# EAGLE design main (EAGLE 7.5.0)
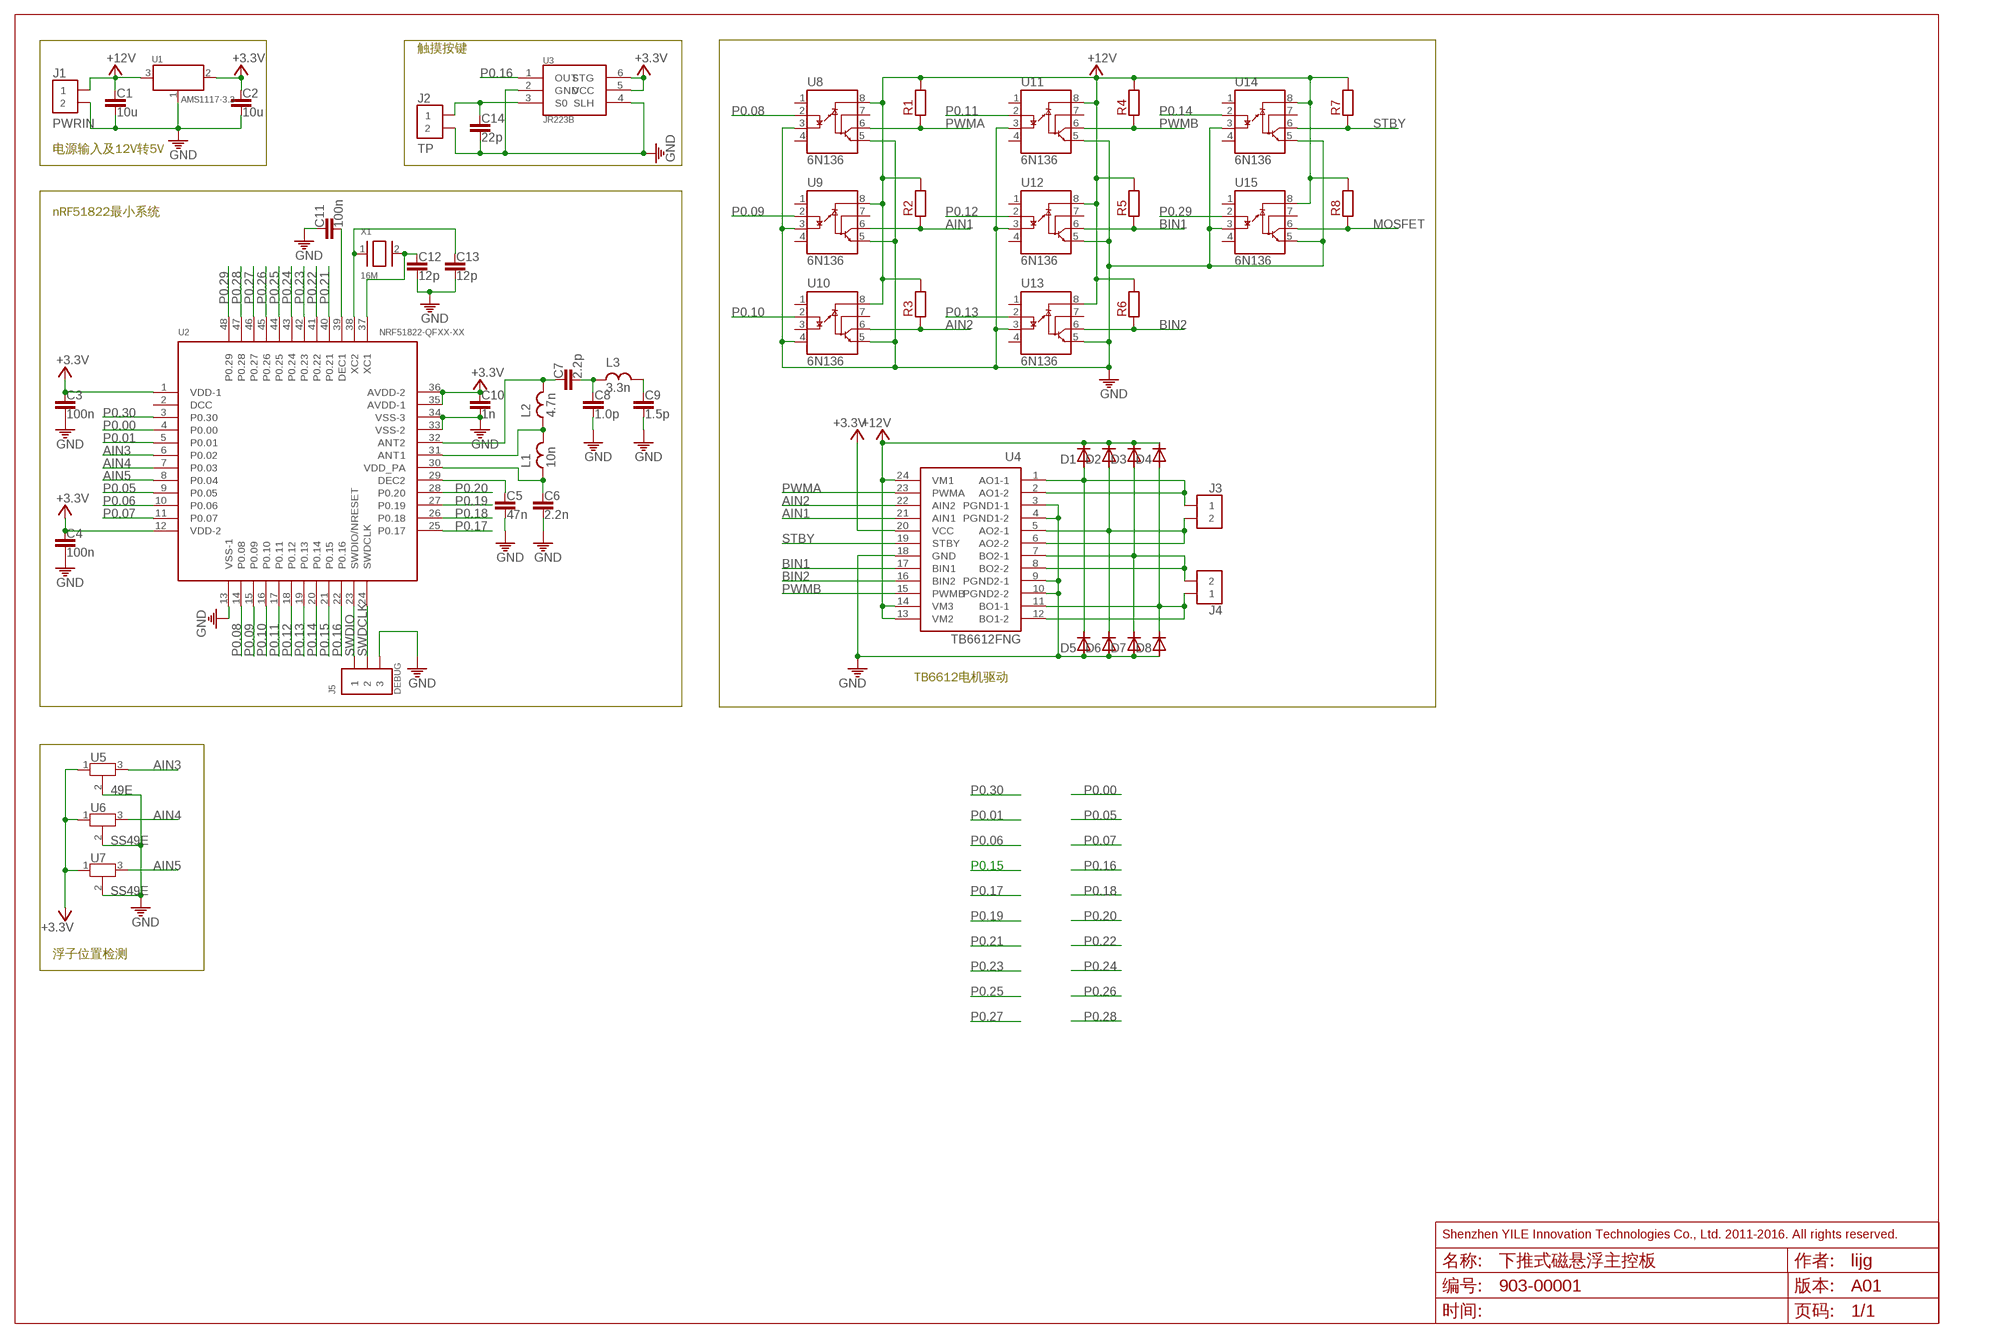
[diagram p0: schematic, sheet 1]
FRAME2 (DINA3_L): AUTHOR: lijg; DOCUMENT_NAME: 下推式磁悬浮主控板; DOCUMENT_NUMBER: 903-00001; REV: A01

## Parts
C1  10u  C0805  [0805]
C2  10u  C0805  [0805]
C3  100n  C0805  [0805]
C4  100n  C0805  [0805]
C5  47n  C0805  [0805]
C6  2.2n  C0805  [0805]
C7  2.2p  C0805  [0805]
C8  1.0p  C0805  [0805]
C9  1.5p  C0805  [0805]
C10  1n  C0805  [0805]
C11  100n  C0805  [0805]
C12  12p  C0805  [0805]
C13  12p  C0805  [0805]
C14  22p  C0805  [0805]
D1  D0805  [0805]
D2  D0805  [0805]
D3  D0805  [0805]
D4  D0805  [0805]
D5  D0805  [0805]
D6  D0805  [0805]
D7  D0805  [0805]
D8  D0805  [0805]
J1  PWRIN  CON2X12X1-DIP2-100  [SIP2-100]
J2  TP  CON2X12X1-DIP2-100  [SIP2-100]
J3  CON2X12X1-DIP2-100  [SIP2-100]
J4  CON2X12X1-DIP2-100  [SIP2-100]
J5  DEBUG  CON3X1  [SIP3-100]
L1  10n  L0805  [0805]
L2  4.7n  L0805  [0805]
L3  3.3n  L0805  [0805]
R1  R0805  [0805]
R2  R0805  [0805]
R3  R0805  [0805]
R4  R0805  [0805]
R5  R0805  [0805]
R6  R0805  [0805]
R7  R0805  [0805]
R8  R0805  [0805]
U1  AMS1117-3.3  AMS1117  [SOT-223]
U2  NRF51822-QFXX-XX  [QFN48-6.0A-0.4A]
U3  JR223B  [SSOP6-P-118-0.6A]
U4  TB6612FNG  [SSOP24-P-300-0.65A]
U5  49E  AH3503  [AH3503]
U6  SS49E  AH3503  [AH3503]
U7  SS49E  AH3503  [AH3503]
U8  6N136  [SOP8-900A-2.54A]
U9  6N136  [SOP8-900A-2.54A]
U10  6N136  [SOP8-900A-2.54A]
U11  6N136  [SOP8-900A-2.54A]
U12  6N136  [SOP8-900A-2.54A]
U13  6N136  [SOP8-900A-2.54A]
U14  6N136  [SOP8-900A-2.54A]
U15  6N136  [SOP8-900A-2.54A]
X1  16M  S5032B  [S5032B]

## Nets
+3.3V: C2.1 C3.1 C4.1 C10.1 U1.2(VOUT) U2.1(VDD-1) U2.12(VDD-2) U2.35(AVDD-1) U2.36(AVDD-2) U3.5(VCC) U3.6(STG) U4.20(VCC) U5.1 U6.1 U7.1
+12V: C1.1 D1.2 D2.2 D3.2 D4.2 J1.P$1 R1.2 R2.2 R3.2 R4.2 R5.2 R6.2 R7.2 R8.2 U1.3(VIN) U4.13(VM2) U4.14(VM3) U4.24(VM1) U8.8(VCC) U9.8(VCC) U10.8(VCC) U11.8(VCC) U12.8(VCC) U13.8(VCC) U14.8(VCC) U15.8(VCC)
AIN1: R2.1 U4.21(AIN1) U9.6(VO)
AIN2: R3.1 U4.22(AIN2) U10.6(VO)
AIN3: U2.6(P0.02) U5.3
AIN4: U2.7(P0.03) U6.3
AIN5: U2.8(P0.04) U7.3
BIN1: R5.1 U4.17(BIN1) U12.6(VO)
BIN2: R6.1 U4.16(BIN2) U13.6(VO)
GND: C1.2 C2.2 C3.2 C4.2 C5.2 C6.2 C8.2 C9.2 C10.2 C11.1 C12.2 C13.2 C14.2 D5.1 D6.1 D7.1 D8.1 J1.P$2 J2.P$2 J5.P$3 U1.1(GND/ADJ) U2.13(VSS-1) U2.33(VSS-2) U2.34(VSS-3) U3.2(GND) U3.4(SLH) U4.3(PGND1-1) U4.4(PGND1-2) U4.9(PGND2-1) U4.10(PGND2-2) U4.18(GND) U5.2 U6.2 U7.2 U8.3(C) U8.5(GND) U9.3(C) U9.5(GND) U10.4(NC2) U10.5(GND) U11.3(C) U11.5(GND) U12.3(C) U12.5(GND) U13.3(C) U13.5(GND) U14.3(C) U14.5(GND) U15.3(C) U15.5(GND)
MOSFET: R8.1 U15.6(VO)
N$2: C6.1 L1.1 U2.30(VDD_PA)
N$3: L1.2 L2.1 U2.31(ANT1)
N$4: C5.1 U2.29(DEC2)
N$5: C7.1 L2.2 U2.32(ANT2)
N$6: C7.2 C8.1 L3.1
N$7: C14.1 J2.P$1 U3.3(S0)
N$8: C12.1 U2.37(XC1) X1.2(X2)
N$9: C13.1 U2.38(XC2) X1.1(X1)
N$10: D1.1 D5.2 J3.P$1 U4.1(AO1-1) U4.2(AO1-2)
N$11: C11.2 U2.39(DEC1)
N$12: D2.1 D6.2 J3.P$2 U4.5(AO2-1) U4.6(AO2-2)
N$13: D3.1 D7.2 J4.P$2 U4.7(BO2-1) U4.8(BO2-2)
N$14: D4.1 D8.2 J4.P$1 U4.11(BO1-1) U4.12(BO1-2)
P0.00: U2.4(P0.00)
P0.01: U2.5(P0.01)
P0.05: U2.9(P0.05)
P0.06: U2.10(P0.06)
P0.07: U2.11(P0.07)
P0.08: U2.14(P0.08) U8.2(A)
P0.09: U2.15(P0.09) U9.2(A)
P0.10: U2.16(P0.10) U10.2(A)
P0.11: U2.17(P0.11) U11.2(A)
P0.12: U2.18(P0.12) U12.2(A)
P0.13: U2.19(P0.13) U13.2(A)
P0.14: U2.20(P0.14) U14.2(A)
P0.15: U2.21(P0.15)
P0.16: U2.22(P0.16) U3.1(OUT)
P0.17: U2.25(P0.17)
P0.18: U2.26(P0.18)
P0.19: U2.27(P0.19)
P0.20: U2.28(P0.20)
P0.21: U2.40(P0.21)
P0.22: U2.41(P0.22)
P0.23: U2.42(P0.23)
P0.24: U2.43(P0.24)
P0.25: U2.44(P0.25)
P0.26: U2.45(P0.26)
P0.27: U2.46(P0.27)
P0.28: U2.47(P0.28)
P0.29: U2.48(P0.29) U15.2(A)
P0.30: U2.3(P0.30)
PWMA: R1.1 U4.23(PWMA) U8.6(VO)
PWMB: R4.1 U4.15(PWMB) U11.6(VO)
STBY: R7.1 U4.19(STBY) U14.6(VO)
SWDCLK: J5.P$2 U2.24(SWDCLK)
SWDIO: J5.P$1 U2.23(SWDIO/NRESET)
WIRE: C9.1 L3.2
Unconnected: U2.2(DCC) U8.1(NC1) U8.4(NC2) U8.7(VB) U9.1(NC1) U9.4(NC2) U9.7(VB) U10.1(NC1) U10.3(C) U10.7(VB) U11.1(NC1) U11.4(NC2) U11.7(VB) U12.1(NC1) U12.4(NC2) U12.7(VB) U13.1(NC1) U13.4(NC2) U13.7(VB) U14.1(NC1) U14.4(NC2) U14.7(VB) U15.1(NC1) U15.4(NC2) U15.7(VB)

## Notes on the sheet
- 触摸按键
- 电源输入及12V转5V
- nRF51822最小系统
- TB6612电机驱动
- 浮子位置检测

## Library data of the parts
C1-C14 = passive:C: 电容
D1-D8 = passive:D: 二极管
J1-J4 = conn:CON2X1: 2X1直插式连接器，间距100mil
J5 = conn:CON3X1
L1-L3 = passive:L: 电感
R1-R8 = passive:R: 电阻
U1 = ic:AMS1117: 1A LOW DROPOUT VOLTAGE REGULATOR
U2 = ic:NRF51822-QFXX-XX: 带有M0内核的蓝牙4.0芯片
U3 = ic:JR223B: 单键电容式触摸按键IC
U4 = ic:TB6612FNG: 双路电机驱动
U5-U7 = ic:AH3503: LINEAR HALL
U8-U15 = ic:6N136: 高速光耦,1MBd
X1 = crystal:S5032B: 2引脚贴片晶振

## Board
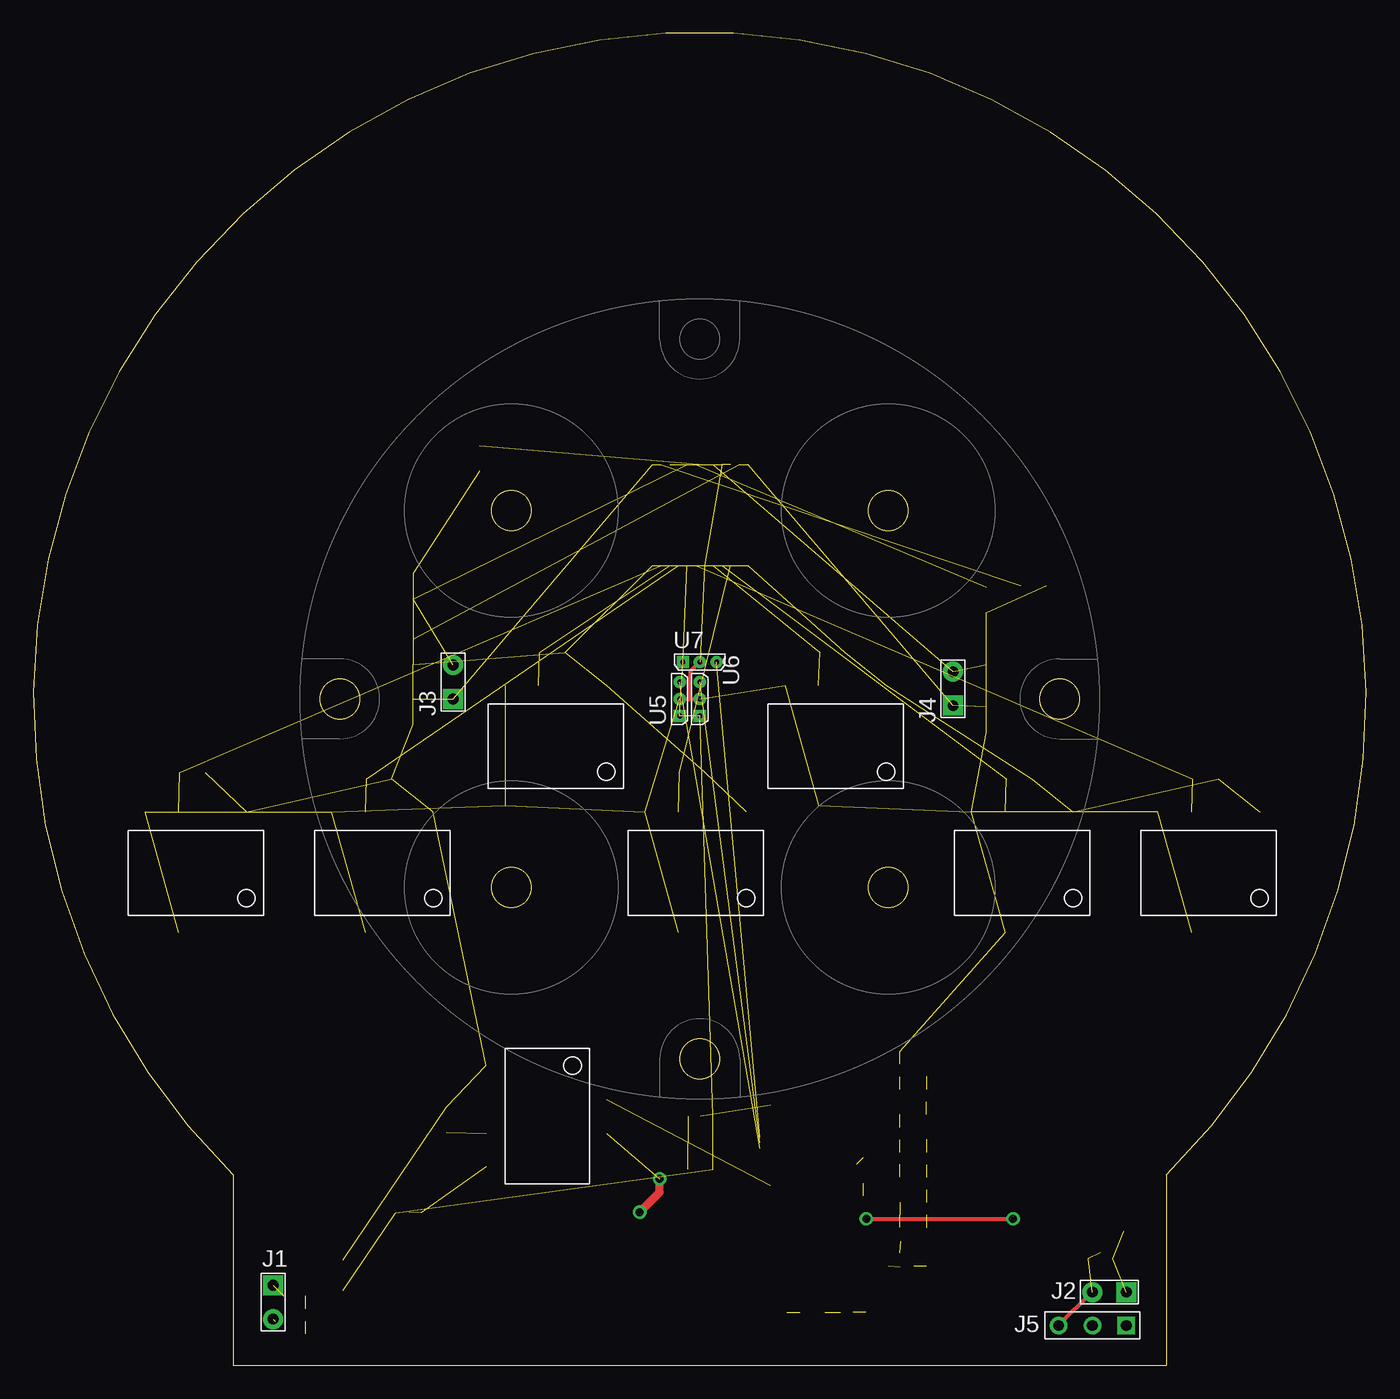
[diagram p1: board, top side]
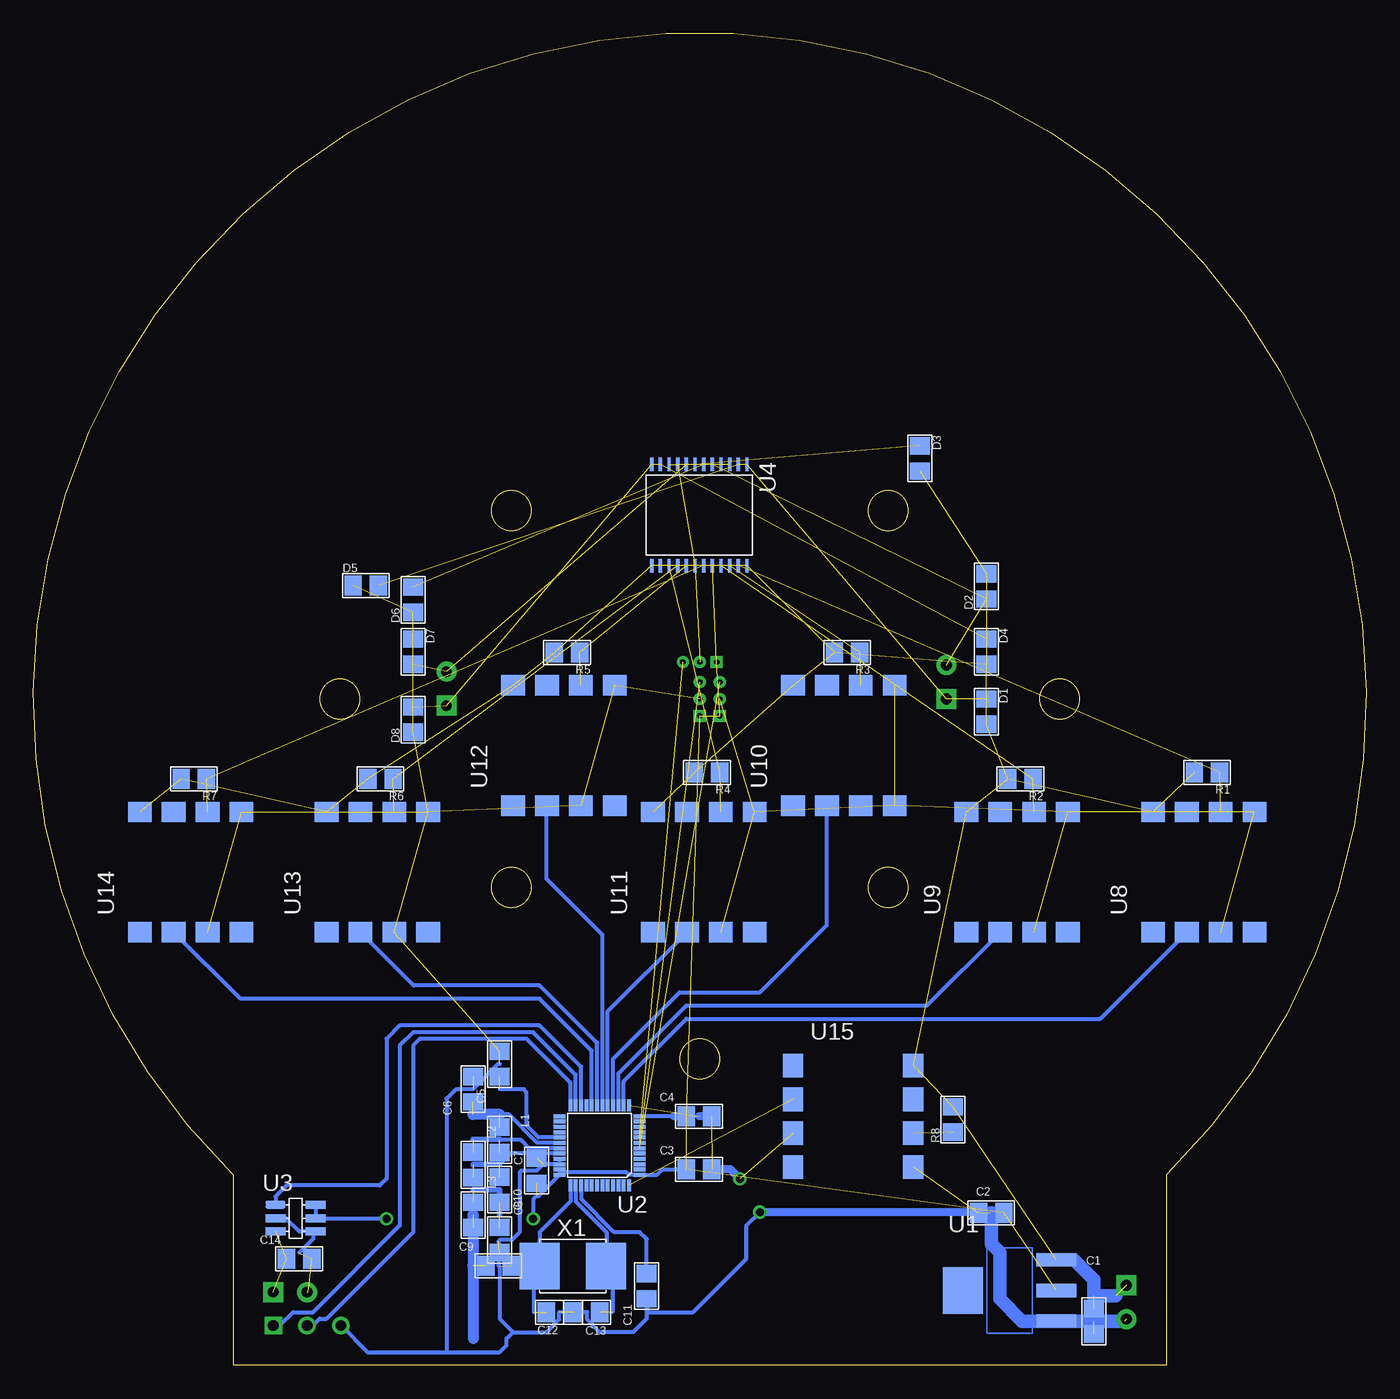
[diagram p2: board, bottom side, seen from below]

Size 99.99 x 99.94 mm. Coordinates in mm from the lower left corner, seen from the top.
Outline: 15,0 85,0 85,14.29 arc271 15,14.29 15,0
Outline: circle at 23,50 radius 1.5
Outline: circle at 50,23 radius 1.5
Outline: circle at 77,50 radius 1.5
Outline: circle at 64.14,64.14 radius 1.5
Outline: circle at 35.86,64.14 radius 1.5
Outline: circle at 35.86,35.86 radius 1.5
Outline: circle at 64.14,35.86 radius 1.5
Copper layers (1*16): Top 0.035mm / dielectric 1.5mm / Bottom 0.035mm
Design rules "default": minimum track width 10mil, minimum drill 24mil, track to track 8mil, track to pad 8mil, pad to pad 8mil, via to via 8mil, smd to smd 8mil, copper to edge 40mil, drill to drill 8mil, minimum pad ring 10mil, minimum via ring 8mil, stop-mask expansion 4mil, vias tented up to drill 0mil, thermal gap 10mil

### Footprints (pad centres in the part's own frame; a part is rotated, then mirrored left to right if it is on the bottom)
0805 = smd 1.3 x 1.5: 1 0,0; 2 1.9,0
SIP2-100 = drill 0.8 pad 1.5 square: P$1 0,0 | drill 0.8 pad 1.5: P$2 2.54,0
SIP3-100 = drill 0.8 square: P$1 0,0 | drill 0.8: P$2 2.54,0; P$3 5.08,0
SOT-223 = smd 1 x 3: 1 -2.3,-3.5; 2 0,-3.5; 3 2.3,-3.5 | smd 3.5 x 3: P$4 0,3.5
QFN48-6.0A-0.4A = smd 0.9 x 0.3: 1 -3,2.2; 2 -3,1.8; 3 -3,1.4; 4 -3,1; 5 -3,0.6; 6 -3,0.2; 7 -3,-0.2; 8 -3,-0.6; 9 -3,-1; 10 -3,-1.4; 11 -3,-1.8; 12 -3,-2.2; 25 3,-2.2; 26 3,-1.8; 27 3,-1.4; 28 3,-1; 29 3,-0.6; 30 3,-0.2; 31 3,0.2; 32 3,0.6; 33 3,1; 34 3,1.4; 35 3,1.8; 36 3,2.2 | smd 0.3 x 0.9: 13 -2.2,-3; 14 -1.8,-3; 15 -1.4,-3; 16 -1,-3; 17 -0.6,-3; 18 -0.2,-3; 19 0.2,-3; 20 0.6,-3; 21 1,-3; 22 1.4,-3; 23 1.8,-3; 24 2.2,-3; 37 2.2,3; 38 1.8,3; 39 1.4,3; 40 1,3; 41 0.6,3; 42 0.2,3; 43 -0.2,3; 44 -0.6,3; 45 -1,3; 46 -1.4,3; 47 -1.8,3; 48 -2.2,3
SSOP6-P-118-0.6A = smd 1.5 x 0.6: 1 0,0; 2 0,-1; 3 0,-2; 4 3,-2; 5 3,-1; 6 3,0
SSOP24-P-300-0.65A = smd 1 x 0.25: 1 -3.8,3.575; 2 -3.8,2.925; 3 -3.8,2.275; 4 -3.8,1.625; 5 -3.8,0.975; 6 -3.8,0.325; 7 -3.8,-0.325; 8 -3.8,-0.975; 9 -3.8,-1.625; 10 -3.8,-2.275; 11 -3.8,-2.925; 12 -3.8,-3.575; 13 3.8,-3.575; 14 3.8,-2.925; 15 3.8,-2.275; 16 3.8,-1.625; 17 3.8,-0.975; 18 3.8,-0.325; 19 3.8,0.325; 20 3.8,0.975; 21 3.8,1.625; 22 3.8,2.275; 23 3.8,2.925; 24 3.8,3.575
AH3503 = drill 0.4 square: 1 -1.27,0 | drill 0.4: 2 0,0; 3 1.27,0
SOP8-900A-2.54A = smd 1.524 x 1.778: 1 0,0; 2 0,-2.54; 3 0,-5.08; 4 0,-7.62; 5 9.017,-7.62; 6 9.017,-5.08; 7 9.017,-2.54; 8 9.017,0
S5032B = smd 3 x 3.5: 1 -2.5,0; 2 2.5,0

### Placement (x,y rotation side)
C1  20.42,4.26 270 bottom
C2  27.18,11.44 180 bottom
C3  51,14.71 0 bottom
C4  51.01,18.7 0 bottom
C5  65,21.66 90 bottom
C6  67.01,19.77 90 bottom
C7  65,14.13 270 bottom
C8  65,10.36 270 bottom
C9  66.06,7.49 0 bottom
C10  62.24,13.66 90 bottom
C11  53.99,5 90 bottom
C12  61.5,4 0 bottom
C13  57.5,4 180 bottom
C14  81,8 0 bottom
D1  28.5,50 270 bottom
D2  28.5,57.5 90 bottom
D3  33.5,69 270 bottom
D4  28.5,54.5 270 bottom
D5  76,58.5 0 bottom
D6  71.5,56.5 90 bottom
D7  71.5,54.5 270 bottom
D8  71.5,47.5 90 bottom
J1  18,6.01 270 top
J2  82,5.5 180 top
J3  31.5,50 90 top
J4  69,49.5 90 top
J5  82,3 180 top
L1  65,17.87 270 bottom
L2  67,16 270 bottom
L3  67,12.24 270 bottom
R1  11,44.5 180 bottom
R2  25,44 180 bottom
R3  38,53.5 180 bottom
R4  48.5,44.5 180 bottom
R5  59,53.5 180 bottom
R6  73,44 180 bottom
R7  87,44 180 bottom
R8  31,17.5 90 bottom
U1  26.75,5.62 90 bottom
U2  57.5,16.5 180 bottom
U3  81.82,12.05 0 bottom
U4  50.03,63.79 270 bottom
U5  48.5,50 90 top
U6  50,50 90 top
U7  50,52.77 0 top
U8  16,32.5 90 bottom
U9  30,32.5 90 bottom
U10  43,42 90 bottom
U11  53.5,32.5 90 bottom
U12  64,42 90 bottom
U13  78,32.5 90 bottom
U14  92,32.5 90 bottom
U15  43,22.5 0 bottom
X1  59.52,7.45 180 bottom

### Tracks (layer width: path | path; a pad name or v marks a point on that pad's centre or on a via)
+3.3V  (via drill 0.6)  (8 unrouted)
  Top 0.305: v62.5,11 v73.5,11
  Bottom 0.305: C4.1 U2.12 | U2.35 U2.36 | U2.36 62.09,12.71 62.24,12.71 62.5,12.45 v62.5,11 | C3.1 52.79,14.71 53.2,14.3 U2.1 55.3,14.3 55.5,14.5 60.3,14.5 U2.36 | U3.6 U3.5 78.5,11 v73.5,11
  Bottom 0.61: C4.1 51.95,18.69
+12V  (25 unrouted)
  Bottom 1.016: 18.8,5.21 20.42,5.21 20.42,6.42 21.92,7.92 U1.3
AIN1  (2 unrouted)
AIN2  (2 unrouted)
AIN3  (1 unrouted)
AIN4  (1 unrouted)
AIN5  (1 unrouted)
BIN1  (2 unrouted)
BIN2  (2 unrouted)
GND  (via drill 0.6)  (41 unrouted)
  Top 0.305: 79.42,5.5 J5.P$3 | U5.2 49.25,50 | 49.25,50 U6.2 | U7.2 49.27,52.04 49.27,51.15 49.25,51.13 49.25,50
  Top 0.61: v47,14 47,13 v45.5,11.5
  Bottom 0.305: U2.33 U2.34 61.75,15.1 62.24,14.61 63.39,14.61 63.5,14.5 63.5,10 64.09,9.41 65,9.41 65.11,9.3 65.11,7.49 65,7.38 65,3.5 64,2.5 | v45.5,11.5 46.5,10.5 46.5,8 50.5,4 53.94,4 C11.1 53.99,3.51 55,2.5 57.5,2.5 58.45,3.45 58.45,4 60.55,4 60.55,3.45 61.5,2.5 64,2.5 | J5.P$3 74.92,1 69,1 | 69,1 65,1 64.5,1.5 64.5,2 64,2.5 | 80.05,8.45 79,9.5 79,9.87 U3.4 80.05,10.05 81.05,11.05 U3.2 | 65,22.61 65.12,22.61 67.01,20.72 68.28,20.72 69,20 69,1
  Bottom 0.61: C4.2 50.05,18.69 | 28.13,11.44 28.19,11.5 v45.5,11.5 | v47,14 47.71,14.71 C3.2
  Bottom 1.016: 18.16,3.31 20.42,3.31 20.43,3.32 U1.1 25.82,3.32 27.5,5 27.5,8.5 28.13,9.13 28.13,11.44
MOSFET  (1 unrouted)
N$1
  Bottom 0.813: 67,7.5 67,2
N$2  (2 unrouted)
  Bottom 0.305: U2.30 62.2,16.7 64.32,18.82 65,18.82
  Bottom 0.813: 65,18.82 67.01,18.82
N$3  (2 unrouted)
  Bottom 0.305: U2.31 62.8,16.3 63.42,16.92 65,16.92
  Bottom 0.406: 65,16.92 65.03,16.95 67,16.95
N$4  (1 unrouted)
  Bottom 0.305: U2.29 62.1,17.1 63,18 63,20.5 63.21,20.71 65,20.71
N$5  (2 unrouted)
  Bottom 0.305: U2.32 64.18,15.9 65,15.08
  Bottom 0.406: 67,15.05 66.97,15.08 65,15.08
N$6  (3 unrouted)
  Bottom 0.406: 67,13.19 65.01,13.19 65,13.18 65,11.31
N$7  (2 unrouted)
N$8  (1 unrouted)
  Bottom 0.305: U2.37 59.7,12.3 62,10 62,7.47 X1.2 62.45,7.02 62.45,4
N$9  (1 unrouted)
  Bottom 0.305: U2.38 59.3,12.3 57,10 57,7.47 | 57,7.47 X1.1 | 57,7.47 56.55,7.02 56.55,4
N$10  (4 unrouted)
N$11
  Bottom 0.305: U2.39 58.9,12.48 56.42,10 54.5,10 53.99,9.49 C11.2
N$12  (4 unrouted)
N$13  (4 unrouted)
N$14  (4 unrouted)
P0.08
  Bottom 0.305: U2.14 55.7,21.3 51,26 19.96,26 U8.2
P0.09
  Bottom 0.305: U2.15 56.1,21.9 51,27 32.96,27 U9.2
P0.10
  Bottom 0.305: U2.16 56.5,23 51.5,28 45.5,28 40.46,33.04 U10.2
P0.11
  Bottom 0.305: U2.17 56.9,26.56 U11.2
P0.12
  Bottom 0.305: U2.18 57.3,32.3 61.5,36.5 61.5,41.96 U12.2
P0.13
  Bottom 0.305: U2.19 57.7,24.2 62,28.5 71.46,28.5 U13.2
P0.14
  Bottom 0.305: U2.20 58.1,23.6 62,27.5 84.46,27.5 U14.2
P0.16
  Bottom 0.305: U2.22 58.9,22.4 62,25.5 72.5,25.5 73.5,24.5 73.5,14 74,13.5 81,13.5 81.82,12.68 U3.1
P0.29  (1 unrouted)
PWMA  (2 unrouted)
PWMB  (2 unrouted)
STBY  (2 unrouted)
SWDCLK
  Bottom 0.305: U2.24 59.7,21.2 63,24.5 71,24.5 71.5,24 71.5,10 78,3.5 78.5,3.5 79,3 J5.P$2
SWDIO
  Bottom 0.305: U2.23 59.3,21.8 62.5,25 71.5,25 72.5,24 72.5,10.5 79,4 80.5,4 81.5,3 J5.P$1
WIRE  (2 unrouted)
  Bottom 0.813: 67,11.29 67.01,11.28 67.01,7.49